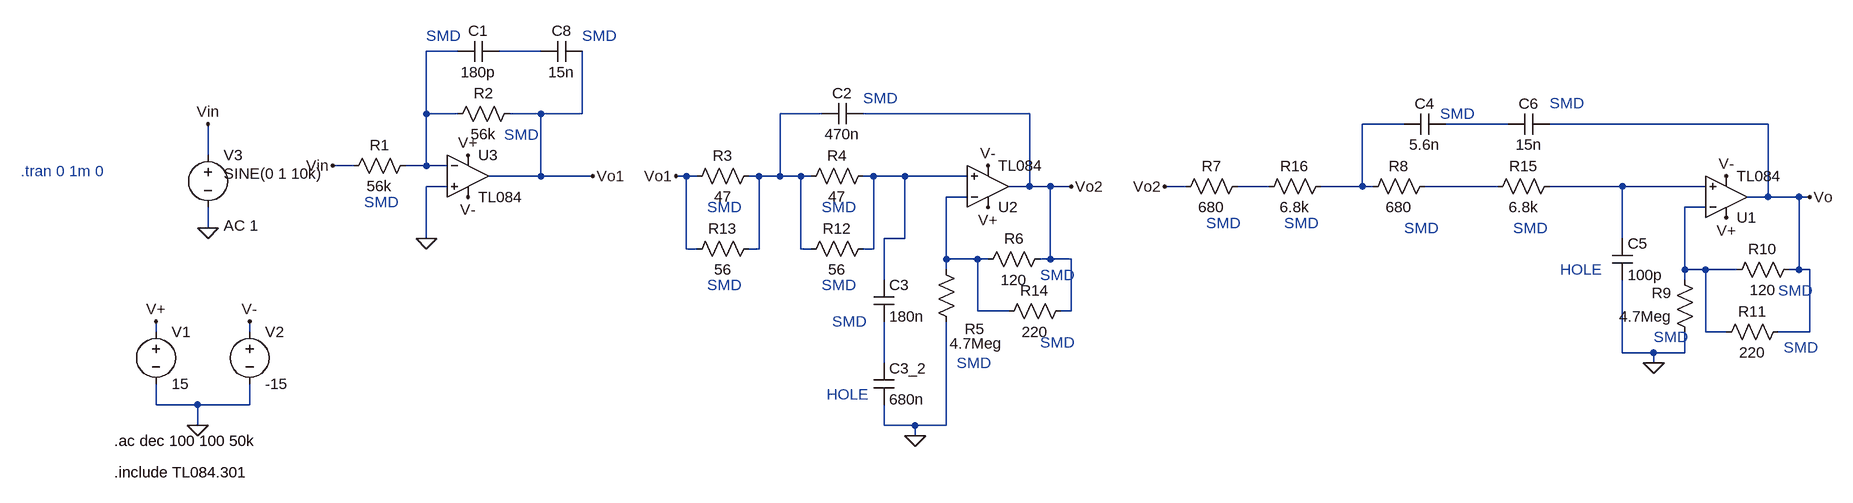
[diagram p0: schematic Legendre SIN tolerancias.asc]
Legendre SIN tolerancias.asc, the LTspice schematic file:
Version 4
SHEET 1 2112 776
WIRE -16 -16 -64 -16
WIRE 112 -16 48 -16
WIRE -64 80 -64 -16
WIRE -16 80 -64 80
WIRE 112 80 64 80
WIRE 176 80 176 -16
WIRE 176 80 112 80
WIRE 544 80 480 80
WIRE 864 80 608 80
WIRE 1440 96 1376 96
WIRE 1600 96 1504 96
WIRE 2000 96 1664 96
WIRE -400 144 -400 96
WIRE -176 160 -208 160
WIRE -64 160 -64 80
WIRE -64 160 -96 160
WIRE -32 160 -64 160
WIRE 112 176 112 80
WIRE 112 176 32 176
WIRE 192 176 112 176
WIRE 336 176 320 176
WIRE 352 176 336 176
WIRE 448 176 432 176
WIRE 480 176 480 80
WIRE 480 176 448 176
WIRE 512 176 480 176
WIRE 528 176 512 176
WIRE 624 176 608 176
WIRE 672 176 624 176
WIRE 768 176 672 176
WIRE -32 192 -64 192
WIRE 864 192 864 80
WIRE 864 192 832 192
WIRE 896 192 864 192
WIRE 928 192 896 192
WIRE 1104 192 1072 192
WIRE 1232 192 1184 192
WIRE 1376 192 1376 96
WIRE 1376 192 1312 192
WIRE 1392 192 1376 192
WIRE 1584 192 1472 192
WIRE 1776 192 1664 192
WIRE 1904 192 1776 192
WIRE 768 208 736 208
WIRE 2000 208 2000 96
WIRE 2000 208 1968 208
WIRE 2048 208 2000 208
WIRE 2064 208 2048 208
WIRE 1904 224 1872 224
WIRE -400 256 -400 224
WIRE -64 272 -64 192
WIRE 672 272 672 176
WIRE 672 272 640 272
WIRE 1776 272 1776 192
WIRE 336 288 336 176
WIRE 352 288 336 288
WIRE 448 288 448 176
WIRE 448 288 432 288
WIRE 512 288 512 176
WIRE 528 288 512 288
WIRE 624 288 624 176
WIRE 624 288 608 288
WIRE 736 304 736 208
WIRE 784 304 736 304
WIRE 800 304 784 304
WIRE 896 304 896 192
WIRE 896 304 880 304
WIRE 928 304 896 304
WIRE 736 320 736 304
WIRE 1872 320 1872 224
WIRE 1904 320 1872 320
WIRE 1952 320 1904 320
WIRE 2048 320 2048 208
WIRE 2048 320 2032 320
WIRE 2064 320 2048 320
WIRE 640 336 640 272
WIRE 1872 336 1872 320
WIRE 784 384 784 304
WIRE 832 384 784 384
WIRE 928 384 928 304
WIRE 928 384 912 384
WIRE -480 416 -480 400
WIRE -336 416 -336 400
WIRE 1904 416 1904 320
WIRE 1936 416 1904 416
WIRE 2064 416 2064 320
WIRE 2064 416 2016 416
WIRE 1776 448 1776 336
WIRE 1824 448 1776 448
WIRE 1872 448 1872 416
WIRE 1872 448 1824 448
WIRE 640 464 640 400
WIRE 1824 464 1824 448
WIRE -480 528 -480 496
WIRE -416 528 -480 528
WIRE -336 528 -336 496
WIRE -336 528 -416 528
WIRE -416 560 -416 528
WIRE 640 560 640 528
WIRE 688 560 640 560
WIRE 736 560 736 400
WIRE 736 560 688 560
WIRE 688 576 688 560
FLAG 1824 464 0
FLAG 1936 240 V+
FLAG 0 144 V+
FLAG 1936 176 V-
FLAG 0 208 V-
FLAG 1072 192 Vo2
FLAG 2064 208 Vo
FLAG 688 576 0
FLAG 800 224 V+
FLAG 800 160 V-
FLAG 320 176 Vo1
FLAG 928 192 Vo2
FLAG -208 160 Vin
FLAG -64 272 0
FLAG 192 176 Vo1
FLAG -416 560 0
FLAG -480 400 V+
FLAG -336 400 V-
FLAG -400 256 0
FLAG -400 96 Vin
SYMBOL Opamps\\opamp2 1936 272 M180
SYMATTR InstName U1
SYMATTR Value TL084
SYMBOL res 1200 176 R90
WINDOW 0 0 56 VBottom 2
WINDOW 3 32 56 VTop 2
SYMATTR InstName R7
SYMATTR Value 680
SYMBOL res 1488 176 R90
WINDOW 0 0 56 VBottom 2
WINDOW 3 32 56 VTop 2
SYMATTR InstName R8
SYMATTR Value 680
SYMBOL res 1888 432 R180
WINDOW 0 36 76 Left 2
WINDOW 3 36 40 Left 2
SYMATTR InstName R9
SYMATTR Value 4.7Meg
SYMBOL res 1936 336 R270
WINDOW 0 32 56 VTop 2
WINDOW 3 0 56 VBottom 2
SYMATTR InstName R10
SYMATTR Value 120
SYMBOL cap 1504 80 R90
WINDOW 0 0 32 VBottom 2
WINDOW 3 32 32 VTop 2
SYMATTR InstName C4
SYMATTR Value 5.6n
SYMBOL Opamps\\opamp2 800 256 M180
SYMATTR InstName U2
SYMATTR Value TL084
SYMBOL res 448 160 R90
WINDOW 0 0 56 VBottom 2
WINDOW 3 32 56 VTop 2
SYMATTR InstName R3
SYMATTR Value 47
SYMBOL res 624 160 R90
WINDOW 0 0 56 VBottom 2
WINDOW 3 32 56 VTop 2
SYMATTR InstName R4
SYMATTR Value 47
SYMBOL res 752 416 R180
WINDOW 0 -43 5 Left 2
WINDOW 3 -70 -18 Left 2
SYMATTR InstName R5
SYMATTR Value 4.7Meg
SYMBOL res 784 320 R270
WINDOW 0 32 56 VTop 2
WINDOW 3 0 56 VBottom 2
SYMATTR InstName R6
SYMATTR Value 120
SYMBOL res -80 144 R90
WINDOW 0 0 56 VBottom 2
WINDOW 3 32 56 VTop 2
SYMATTR InstName R1
SYMATTR Value 56k
SYMBOL Opamps\\opamp2 0 112 R0
SYMATTR InstName U3
SYMATTR Value TL084
SYMBOL cap 48 -32 R90
WINDOW 0 0 32 VBottom 2
WINDOW 3 32 32 VTop 2
SYMATTR InstName C1
SYMATTR Value 180p
SYMBOL res 80 64 R90
WINDOW 0 0 56 VBottom 2
WINDOW 3 32 56 VTop 2
SYMATTR InstName R2
SYMATTR Value 56k
SYMBOL voltage -480 400 R0
WINDOW 123 0 0 Left 0
WINDOW 39 0 0 Left 0
SYMATTR InstName V1
SYMATTR Value 15
SYMBOL voltage -336 400 R0
WINDOW 123 0 0 Left 0
WINDOW 39 0 0 Left 0
SYMATTR InstName V2
SYMATTR Value -15
SYMBOL voltage -400 128 R0
WINDOW 123 24 124 Left 2
WINDOW 39 0 0 Left 0
WINDOW 3 24 44 Left 2
SYMATTR Value2 AC 1
SYMATTR InstName V3
SYMATTR Value SINE(0 1 10k)
SYMBOL cap 608 64 R90
WINDOW 0 0 32 VBottom 2
WINDOW 3 32 32 VTop 2
SYMATTR InstName C2
SYMATTR Value 470n
SYMBOL cap 624 464 R0
SYMATTR InstName C3_2
SYMATTR Value 680n
SYMBOL cap 1760 272 R0
SYMATTR InstName C5
SYMATTR Value 100p
SYMBOL cap 1664 80 R90
WINDOW 0 0 32 VBottom 2
WINDOW 3 32 32 VTop 2
SYMATTR InstName C6
SYMATTR Value 15n
SYMBOL res 2032 400 R90
WINDOW 0 0 56 VBottom 2
WINDOW 3 32 56 VTop 2
SYMATTR InstName R11
SYMATTR Value 220
SYMBOL res 624 272 R90
WINDOW 0 0 56 VBottom 2
WINDOW 3 32 56 VTop 2
SYMATTR InstName R12
SYMATTR Value 56
SYMBOL res 448 272 R90
WINDOW 0 0 56 VBottom 2
WINDOW 3 32 56 VTop 2
SYMATTR InstName R13
SYMATTR Value 56
SYMBOL res 928 368 R90
WINDOW 0 0 56 VBottom 2
WINDOW 3 32 56 VTop 2
SYMATTR InstName R14
SYMATTR Value 220
SYMBOL cap 624 336 R0
SYMATTR InstName C3
SYMATTR Value 180n
SYMBOL cap 176 -32 R90
WINDOW 0 0 32 VBottom 2
WINDOW 3 32 32 VTop 2
SYMATTR InstName C8
SYMATTR Value 15n
SYMBOL res 1680 176 R90
WINDOW 0 0 56 VBottom 2
WINDOW 3 32 56 VTop 2
SYMATTR InstName R15
SYMATTR Value 6.8k
SYMBOL res 1328 176 R90
WINDOW 0 0 56 VBottom 2
WINDOW 3 32 56 VTop 2
SYMATTR InstName R16
SYMATTR Value 6.8k
TEXT -544 584 Left 2 !.ac dec 100 100 50k
TEXT -544 632 Left 2 !.include TL084.301
TEXT 752 464 Left 2 ;SMD
TEXT 1824 424 Left 2 ;SMD
TEXT 2016 352 Left 2 ;SMD
TEXT 880 328 Left 2 ;SMD
TEXT 880 432 Left 2 ;SMD
TEXT 2024 440 Left 2 ;SMD
TEXT 1440 256 Left 2 ;SMD
TEXT 1136 248 Left 2 ;SMD
TEXT 1256 248 Left 2 ;SMD
TEXT 1608 256 Left 2 ;SMD
TEXT 544 224 Left 2 ;SMD
TEXT 368 224 Left 2 ;SMD
TEXT 544 344 Left 2 ;SMD
TEXT 368 344 Left 2 ;SMD
TEXT -160 216 Left 2 ;SMD
TEXT 56 112 Left 2 ;SMD
TEXT -64 -40 Left 2 ;SMD
TEXT 176 -40 Left 2 ;SMD
TEXT 608 56 Left 2 ;SMD
TEXT 560 400 Left 2 ;SMD
TEXT 552 512 Left 2 ;HOLE
TEXT 1496 80 Left 2 ;SMD
TEXT 1664 64 Left 2 ;SMD
TEXT 1680 320 Left 2 ;HOLE
TEXT -688 168 Left 2 ;.tran 0 1m 0

The netlist it stands for:
* Legendre SIN tolerancias.asc
XU1 N009 N011 V+ V- Vo TL084  ; pins In+ In- V+ V- OUT
R7 N007 Vo2 680
R8 N008 N004 680
R9 0 N011 4.7Meg
R10 N011 Vo 120
C4 N005 N004 5.6n
XU2 N006 N010 V+ V- Vo2 TL084  ; pins In+ In- V+ V- OUT
R3 N003 Vo1 47
R4 N006 N003 47
R5 0 N010 4.7Meg
R6 N010 Vo2 120
R1 N001 Vin 56k
XU3 0 N001 V+ V- Vo1 TL084  ; pins In+ In- V+ V- OUT
C1 N002 N001 180p
R2 Vo1 N001 56k
V1 V+ 0 15
V2 V- 0 -15
V3 Vin 0 SINE(0 1 10k) AC 1
C2 Vo2 N003 470n
C3_2 N012 0 680n
C5 N009 0 100p
C6 Vo N005 15n
R11 Vo N011 220
R12 N006 N003 56
R13 N003 Vo1 56
R14 Vo2 N010 220
C3 N006 N012 180n
C8 Vo1 N002 15n
R15 N009 N008 6.8k
R16 N004 N007 6.8k
.ac dec 100 100 50k
.include TL084.301
* SMD
* SMD
* SMD
* SMD
* SMD
* SMD
* SMD
* SMD
* SMD
* SMD
* SMD
* SMD
* SMD
* SMD
* SMD
* SMD
* SMD
* SMD
* SMD
* SMD
* HOLE
* SMD
* SMD
* HOLE
* .tran 0 1m 0
.backanno
.end